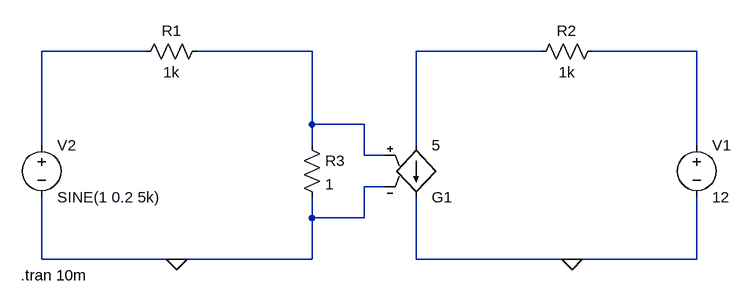
[diagram p0: schematic ex8a.asc]
ex8a.asc, the LTspice schematic file:
Version 4
SHEET 1 1288 680
WIRE 384 -96 224 -96
WIRE 640 -96 464 -96
WIRE 992 -96 800 -96
WIRE 1232 -96 1072 -96
WIRE 640 16 640 -96
WIRE 720 16 640 16
WIRE 224 48 224 -96
WIRE 640 48 640 16
WIRE 800 48 800 -96
WIRE 1232 48 1232 -96
WIRE 720 64 720 16
WIRE 752 64 720 64
WIRE 752 112 720 112
WIRE 640 160 640 128
WIRE 720 160 720 112
WIRE 720 160 640 160
WIRE 224 224 224 128
WIRE 432 224 224 224
WIRE 640 224 640 160
WIRE 640 224 432 224
WIRE 800 224 800 128
WIRE 1040 224 800 224
WIRE 1232 224 1232 128
WIRE 1232 224 1040 224
FLAG 1040 224 0
FLAG 432 224 0
SYMBOL res 480 -112 R90
WINDOW 0 0 56 VBottom 2
WINDOW 3 32 56 VTop 2
SYMATTR InstName R1
SYMATTR Value 1k
SYMBOL voltage 1232 32 R0
WINDOW 123 0 0 Left 2
WINDOW 39 0 0 Left 2
SYMATTR InstName V1
SYMATTR Value 12
SYMBOL res 976 -80 R270
WINDOW 0 32 56 VTop 2
WINDOW 3 0 56 VBottom 2
SYMATTR InstName R2
SYMATTR Value 1k
SYMBOL voltage 224 32 R0
WINDOW 123 0 0 Left 2
WINDOW 39 0 0 Left 2
SYMATTR InstName V2
SYMATTR Value SINE(1 0.2 5k)
SYMBOL res 624 32 R0
SYMATTR InstName R3
SYMATTR Value 1
SYMBOL g2 800 144 M180
SYMATTR InstName G1
SYMATTR Value 5
TEXT 192 248 Left 2 !.tran 10m

The netlist it stands for:
* ex8a.asc
R1 N002 N001 1k
V1 N004 0 12
R2 N003 N004 1k
V2 N001 0 SINE(1 0.2 5k)
R3 N002 0 1
G1 N003 0 N002 0 5
.tran 10m
.backanno
.end